# EAGLE design spherebot-r1 (EAGLE 5.12)
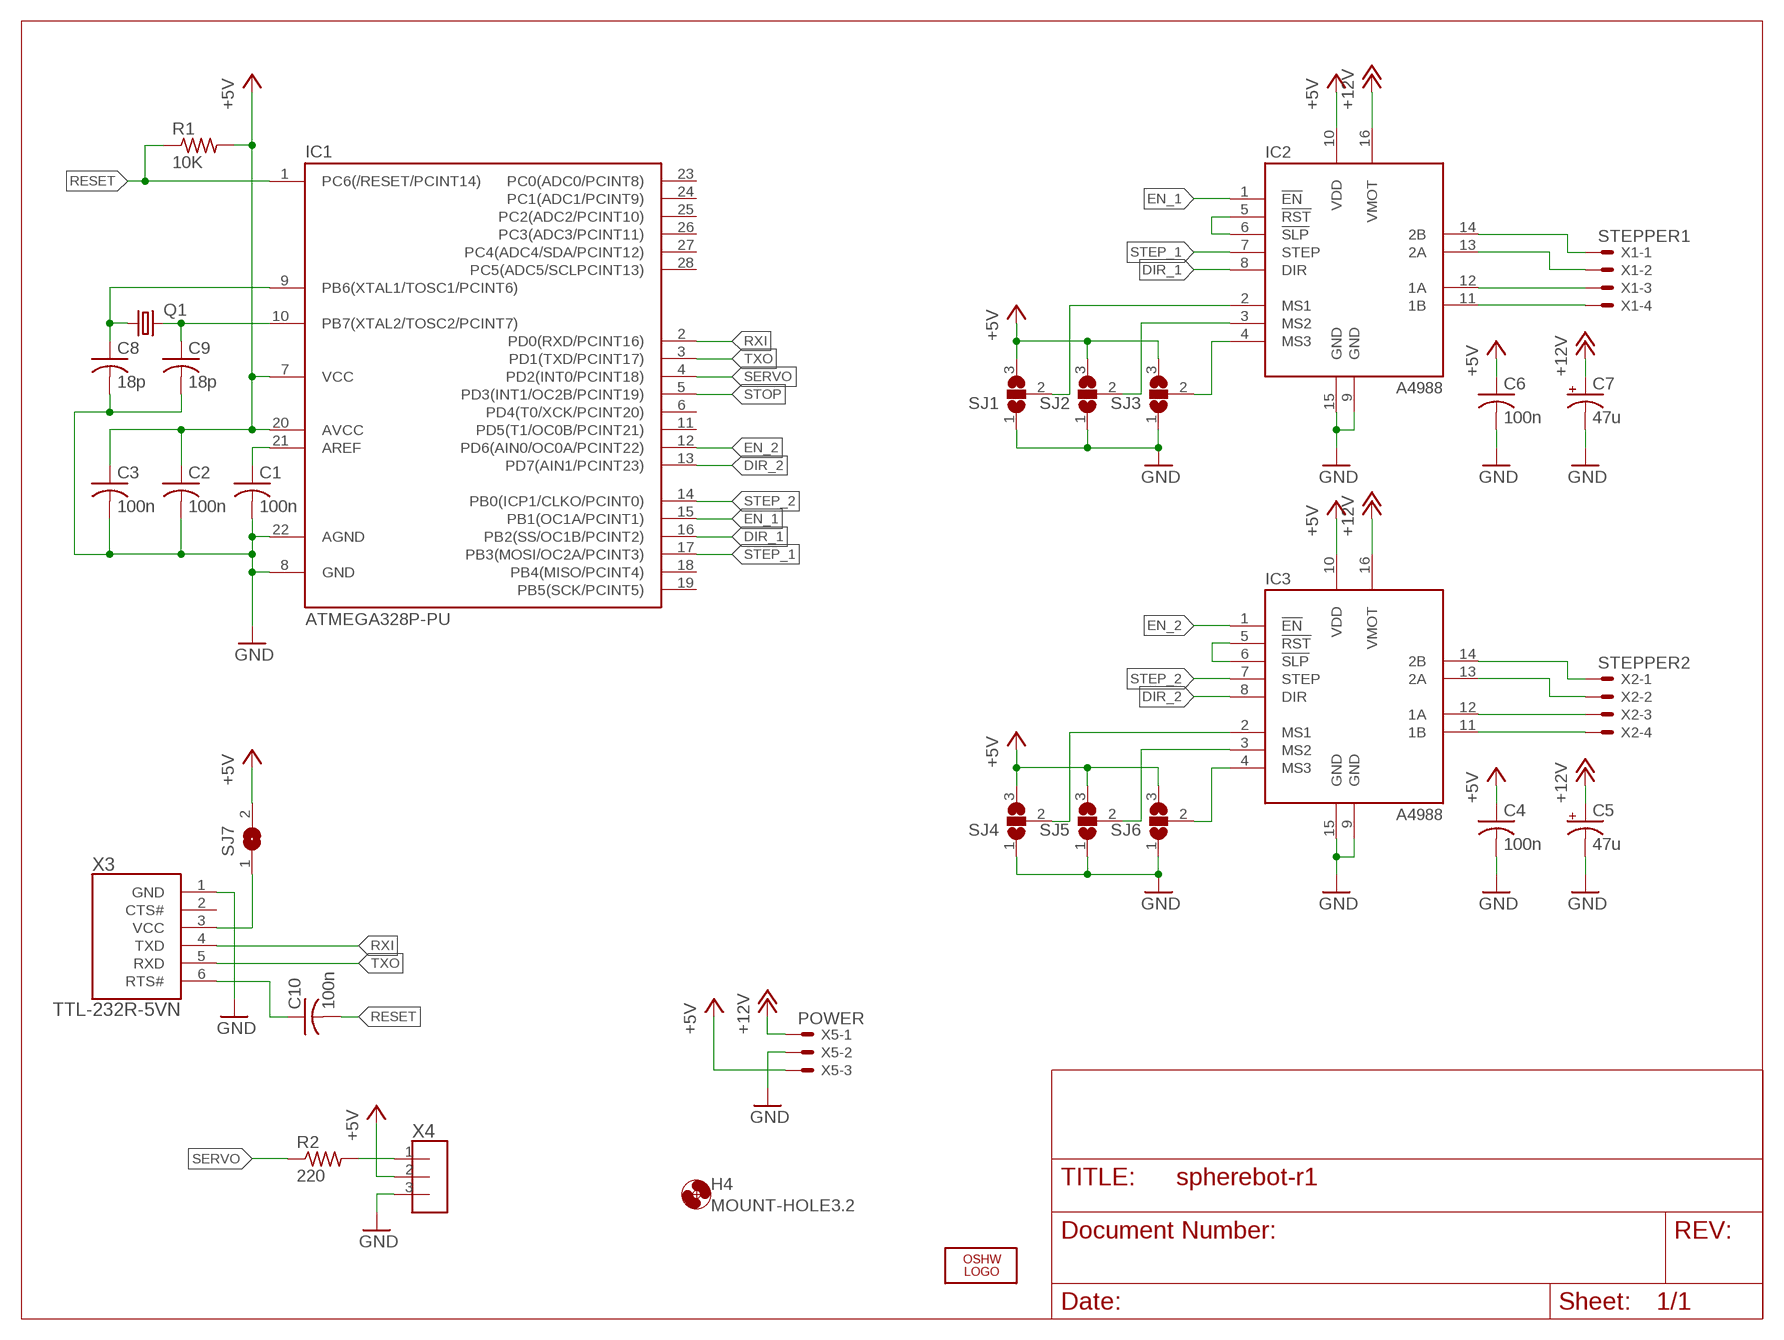
[diagram p0: schematic, sheet 1]

## Parts
C1  100n  C-US050-025X075  [C050-025X075]
C2  100n  C-US050-025X075  [C050-025X075]
C3  100n  C-US050-025X075  [C050-025X075]
C4  100n  C-US050-025X075  [C050-025X075]
C5  47u  CPOL-USE2.5-6  [E2,5-6]
C6  100n  C-US050-025X075  [C050-025X075]
C7  47u  CPOL-USE2.5-6  [E2,5-6]
C8  18p  C-US025-025X050  [C025-025X050]
C9  18p  C-US025-025X050  [C025-025X050]
C10  100n  C-US050-025X075  [C050-025X075]
H4  MOUNT-HOLE3.2  [3,2]
IC1  ATMEGA328P-PU  MEGA48/88/168-PU  [DIL28-3]
IC2  A4988  [POLOLU-STEPPER]
IC3  A4988  [POLOLU-STEPPER]
LOGO1  OSHW_LOGO_FILLX0150-NT  [OSHW_FILLX150_NOTEXT]
Q1  CRYSTALHC49S  [HC49/S]
R1  10K  R-US_0207/10  [0207/10]
R2  220  R-US_0207/10  [0207/10]
SJ1  SJ2W  [SJ_2]
SJ2  SJ2W  [SJ_2]
SJ3  SJ2W  [SJ_2]
SJ4  SJ2W  [SJ_2]
SJ5  SJ2W  [SJ_2]
SJ6  SJ2W  [SJ_2]
SJ7  SJ  [SJ]
X1  STEPPER1  22-23-2041  [22-23-2041]
X2  STEPPER2  22-23-2041  [22-23-2041]
X3  TTL-232R-5VN  [USBCABLE-0.100-NOLBL]
X4  M03-100MIL  [100MIL-3]
X5  POWER  22-23-2031  [22-23-2031]

## Nets
+5V: C2.1 C3.1 C4.1 C6.1 IC1.7(VCC) IC1.20(AVCC) IC2.10(VDD) IC3.10(VDD) R1.2 SJ1.3 SJ2.3 SJ3.3 SJ4.3 SJ5.3 SJ6.3 SJ7.2 X4.2 X5.3
+12V: C5.+ C7.+ IC2.16(VMOT) IC3.16(VMOT) X5.1
DIR_1: IC1.16(PB2(SS/OC1B/PCINT2)) IC2.8(DIR)
DIR_2: IC1.13(PD7(AIN1/PCINT23)) IC3.8(DIR)
EN_1: IC1.15(PB1(OC1A/PCINT1)) IC2.1(!EN)
EN_2: IC1.12(PD6(AIN0/OC0A/PCINT22)) IC3.1(!EN)
GND: C1.2 C2.2 C3.2 C4.2 C5.- C6.2 C7.- C8.2 C9.2 IC1.8(GND) IC1.22(AGND) IC2.9(GND) IC2.15(GND) IC3.9(GND) IC3.15(GND) SJ1.1 SJ2.1 SJ3.1 SJ4.1 SJ5.1 SJ6.1 X3.1(GND) X4.3 X5.2
N$1: IC2.14(2B) X1.1
N$2: IC2.13(2A) X1.2
N$3: IC2.12(1A) X1.3
N$4: IC2.5(!RST) IC2.6(!SLP)
N$5: IC2.11(1B) X1.4
N$6: IC3.5(!RST) IC3.6(!SLP)
N$7: C1.1 IC1.21(AREF)
N$8: IC3.14(2B) X2.1
N$9: IC3.13(2A) X2.2
N$10: IC3.12(1A) X2.3
N$11: IC3.11(1B) X2.4
N$12: C8.1 IC1.9(PB6(XTAL1/TOSC1/PCINT6)) Q1.1
N$13: C9.1 IC1.10(PB7(XTAL2/TOSC2/PCINT7)) Q1.2
N$14: IC2.2(MS1) SJ1.2
N$15: IC2.3(MS2) SJ2.2
N$16: IC2.4(MS3) SJ3.2
N$17: R2.2 X4.1
N$18: SJ7.1 X3.3(VCC)
N$19: IC3.2(MS1) SJ4.2
N$20: IC3.3(MS2) SJ5.2
N$21: IC3.4(MS3) SJ6.2
N$23: C10.1 X3.6(RTS#)
RESET: C10.2 IC1.1(PC6(/RESET/PCINT14)) R1.1
RXI: IC1.2(PD0(RXD/PCINT16)) X3.4(TXD)
SERVO: IC1.4(PD2(INT0/PCINT18)) R2.1
STEP_1: IC1.17(PB3(MOSI/OC2A/PCINT3)) IC2.7(STEP)
STEP_2: IC1.14(PB0(ICP1/CLKO/PCINT0)) IC3.7(STEP)
STOP: IC1.5(PD3(INT1/OC2B/PCINT19))
TXO: IC1.3(PD1(TXD/PCINT17)) X3.5(RXD)
Unconnected: IC1.6(PD4(T0/XCK/PCINT20)) IC1.11(PD5(T1/OC0B/PCINT21)) IC1.18(PB4(MISO/PCINT4)) IC1.19(PB5(SCK/PCINT5)) IC1.23(PC0(ADC0/PCINT8)) IC1.24(PC1(ADC1/PCINT9)) IC1.25(PC2(ADC2/PCINT10)) IC1.26(PC3(ADC3/PCINT11)) IC1.27(PC4(ADC4/SDA/PCINT12)) IC1.28(PC5(ADC5/SCLPCINT13)) X3.2(CTS#)

## Library data of the parts
C1-C4 C6 C8-C10 = rcl:C-US: CAPACITOR, American symbol
C5 C7 = rcl:CPOL-US: POLARIZED CAPACITOR, American symbol
H4 = holes:MOUNT-HOLE: MOUNTING HOLE with drill center marker
IC1 = avr-5:MEGA48/88/168-PU
IC2 IC3 = rbg-pololu-stepper:A4988
LOGO1 = ohw-logo:OSHW_LOGO_FILL
Q1 = crystal:CRYSTAL: CRYSTAL; OC_FARNELL: 1667008; OC_NEWARK: unknown
R1 R2 = rcl:R-US_: RESISTOR, American symbol
SJ1-SJ6 = jumper:SJ2W: SMD solder JUMPER
SJ7 = jumper:SJ: SMD solder JUMPER
X1 X2 = con-molex:22-23-2041: .100" (2.54mm) Center Header - 4 Pin; MF: MOLEX; MPN: 22-23-2041; OC_FARNELL: 1462920; OC_NEWARK: 38C0355
X3 = rbg-ftdi-usb:TTL-232R-5V
X4 = rbg-generic-headers:M03-100MIL
X5 = con-molex:22-23-2031: .100" (2.54mm) Center Header - 3 Pin; MF: MOLEX; MPN: 22-23-2031; OC_FARNELL: 1462950; OC_NEWARK: 30C0862

## Board
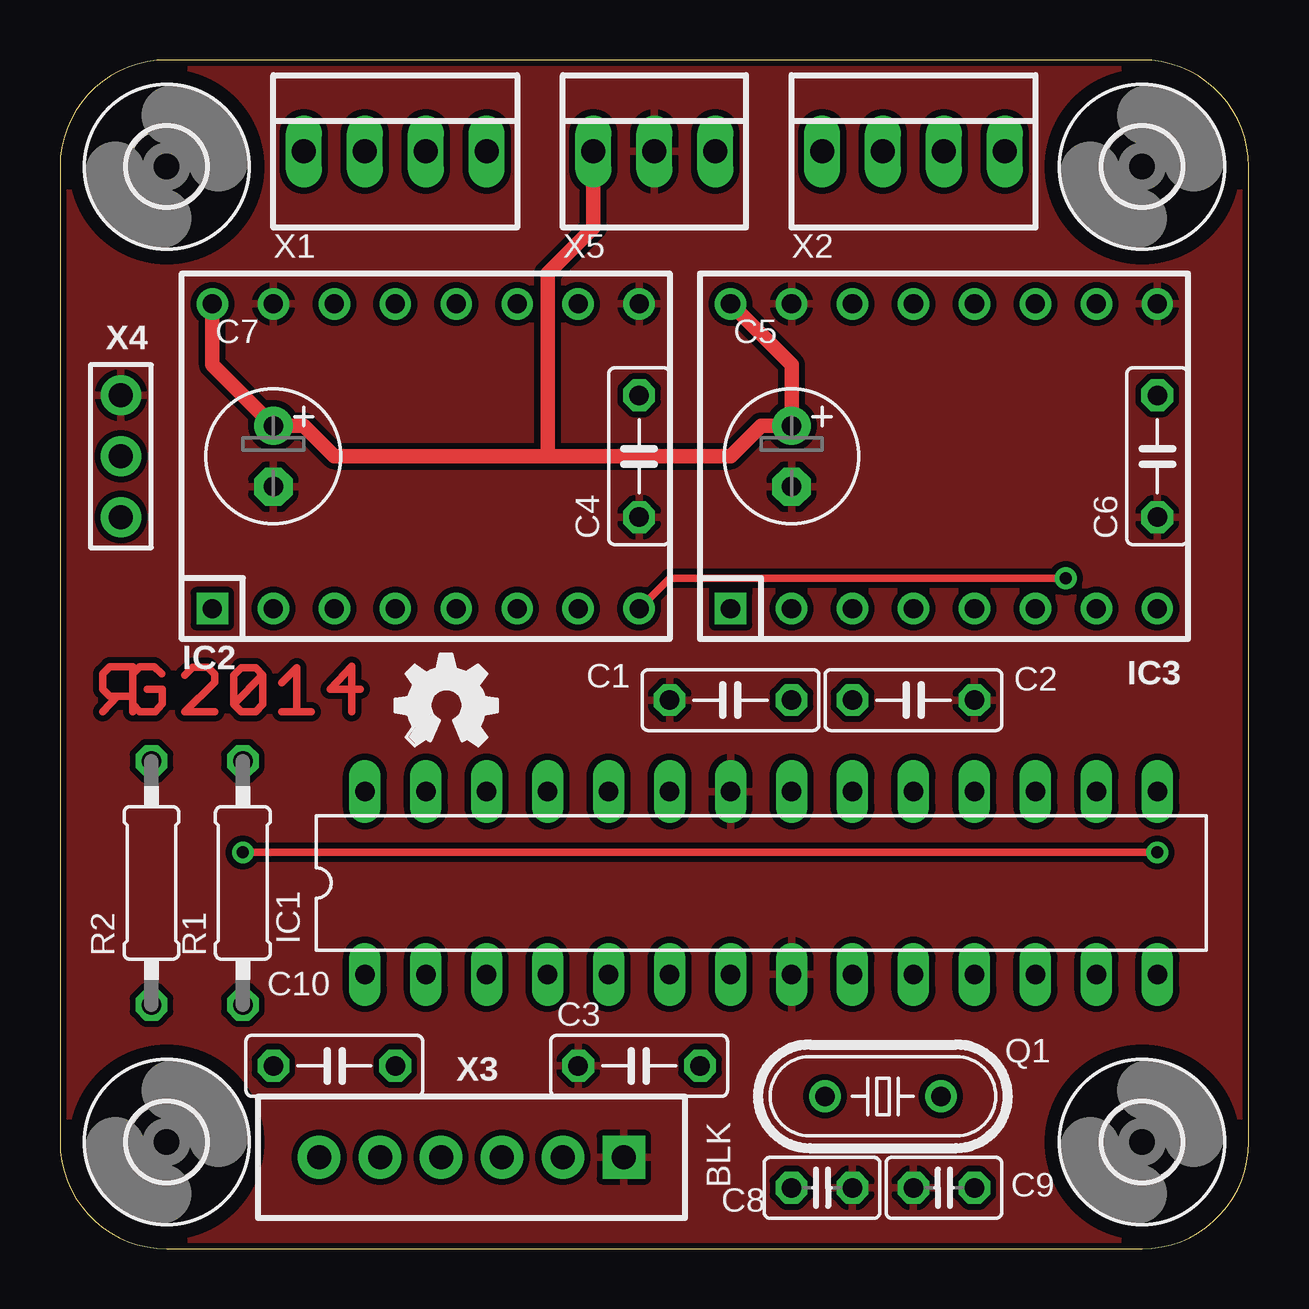
[diagram p1: board, top side]
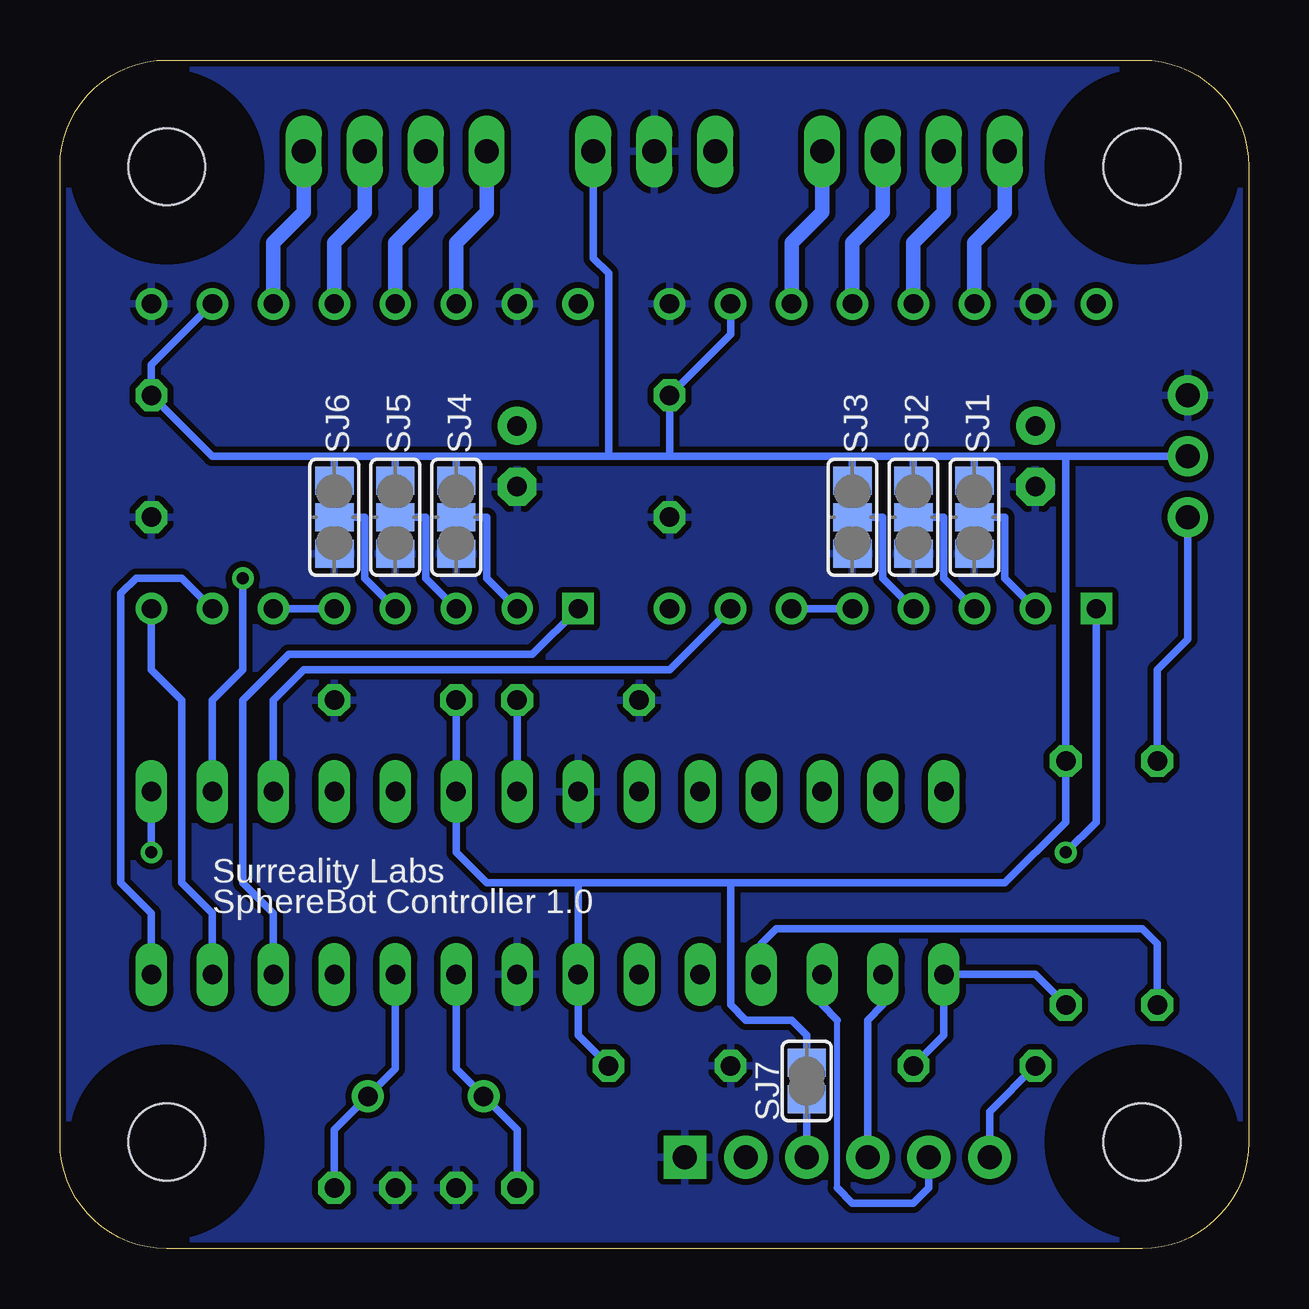
[diagram p2: board, bottom side, seen from below]

Size 49.53 x 49.53 mm. Coordinates in mm from the lower left corner, seen from the top.
Outline: 4.45,49.53 arc90 0,45.09 0,4.45 arc90 4.45,0 45.09,0 arc90 49.53,4.45 49.53,45.09 arc90 45.09,49.53 4.45,49.53
Copper layers (1*16): Top 0.035mm / dielectric 1.5mm / Bottom 0.035mm
Design rules "default *": minimum track width 10mil, minimum drill 0.5mm, track to track 10mil, track to pad 10mil, pad to pad 10mil, via to via 10mil, smd to smd 10mil, copper to edge 10mil, drill to drill 8mil, minimum pad ring 10mil, minimum via ring 8mil, stop-mask expansion 4mil, vias tented up to drill 20mil, thermal gap 10mil

### Footprints (pad centres in the part's own frame; a part is rotated, then mirrored left to right if it is on the bottom)
C050-025X075 = drill 0.813 octagon: 1 -2.54,0; 2 2.54,0
E2,5-6 = drill 0.813 pad 1.6 round: + -1.27,0 | drill 0.813 pad 1.6 octagon: - 1.27,0
C025-025X050 = drill 0.813 octagon: 1 -1.27,0; 2 1.27,0
3,2 = hole 3.2: 0,0
DIL28-3 = drill 0.813 long: 1 -16.51,-3.81; 2 -13.97,-3.81; 3 -11.43,-3.81; 4 -8.89,-3.81; 5 -6.35,-3.81; 6 -3.81,-3.81; 7 -1.27,-3.81; 8 1.27,-3.81; 9 3.81,-3.81; 10 6.35,-3.81; 11 8.89,-3.81; 12 11.43,-3.81; 13 13.97,-3.81; 14 16.51,-3.81; 15 16.51,3.81; 16 13.97,3.81; 17 11.43,3.81; 18 8.89,3.81; 19 6.35,3.81; 20 3.81,3.81; 21 1.27,3.81; 22 -1.27,3.81; 23 -3.81,3.81; 24 -6.35,3.81; 25 -8.89,3.81; 26 -11.43,3.81; 27 -13.97,3.81; 28 -16.51,3.81
POLOLU-STEPPER = drill 0.8 square: 1 -8.89,-6.35 | drill 0.8 round: 2 -6.35,-6.35; 3 -3.81,-6.35; 4 -1.27,-6.35; 5 1.27,-6.35; 6 3.81,-6.35; 7 6.35,-6.35; 8 8.89,-6.35; 9 8.89,6.35; 10 6.35,6.35; 11 3.81,6.35; 12 1.27,6.35; 13 -1.27,6.35; 14 -3.81,6.35; 15 -6.35,6.35; 16 -8.89,6.35
HC49/S = drill 0.813 round: 1 -2.413,0; 2 2.413,0
0207/10 = drill 0.813 octagon: 1 -5.08,0; 2 5.08,0
SJ_2 = smd 1.168 x 1.6: 1 -1.524,0; 2 0,0; 3 1.524,0
SJ = smd 1.168 x 1.6: 1 -0.762,0; 2 0.762,0
22-23-2041 = drill 1 long: 1 -3.81,0; 2 -1.27,0; 3 1.27,0; 4 3.81,0
USBCABLE-0.100-NOLBL = drill 1 pad 1.778 square: 1 0,-7.62 | drill 1 pad 1.778 round: 2 0,-5.08; 3 0,-2.54; 4 0,0; 5 0,2.54; 6 0,5.08
100MIL-3 = drill 1 pad 1.676 round: 1 -2.54,0; 2 0,0; 3 2.54,0
22-23-2031 = drill 1 long: 1 -2.54,0; 2 0,0; 3 2.54,0

### Placement (x,y rotation side)
C1  27.94,22.86 180 top
C2  35.56,22.86 0 top
C3  24.13,7.62 180 top
C4  24.13,33.02 270 top
C5  30.48,33.02 270 top
C6  45.72,33.02 270 top
C7  8.89,33.02 270 top
C8  31.75,2.54 0 top
C9  36.83,2.54 180 top
C10  11.43,7.62 0 top
H1  MOUNT-HOLE3.2  [3,2]  4.45,45.09 0 top
H2  MOUNT-HOLE3.2  [3,2]  45.09,45.09 0 top
H3  MOUNT-HOLE3.2  [3,2]  4.45,4.45 0 top
H4  45.09,4.45 0 top
IC1  29.21,15.24 0 top
IC2  15.24,33.02 0 top
IC3  36.83,33.02 0 top
LOGO1  13.97,20.95 0 top
Q1  34.29,6.35 0 top
R1  7.62,15.24 90 top
R2  3.81,15.24 90 top
SJ1  11.43,30.48 90 bottom
SJ2  13.97,30.48 90 bottom
SJ3  16.51,30.48 90 bottom
SJ4  33.02,30.48 90 bottom
SJ5  35.56,30.48 90 bottom
SJ6  38.1,30.48 90 bottom
SJ7  18.41,6.99 90 bottom
U$1  [RGLOGO_SMALL_2014]  3.17,22.23 0 top
X1  13.97,45.72 0 top
X2  35.56,45.72 0 top
X3  15.88,3.81 90 top
X4  2.54,33.02 90 top
X5  24.77,45.72 0 top

### Tracks (layer width: path | path; a pad name or v marks a point on that pad's centre or on a via)
+5V
  Bottom 0.305: C3.1 27.94,8.89 IC1.7 27.94,15.24 | C2.1 IC1.20 33.02,16.51 31.75,15.24 27.94,15.24 | IC2.10 21.59,38.1 C4.1 24.13,33.02 | 24.13,33.02 26.67,33.02 | 26.67,33.02 33.02,33.02 | 33.02,33.02 35.56,33.02 | 35.56,33.02 38.1,33.02 | 38.1,33.02 43.18,33.02 C6.1 45.72,36.83 IC3.10 | 7.62,33.02 R1.2 7.62,17.78 10.16,15.24 21.59,15.24 | 7.62,33.02 11.43,33.02 | 11.43,33.02 13.97,33.02 | 13.97,33.02 16.51,33.02 | 16.51,33.02 24.13,33.02 | 21.59,15.24 27.94,15.24 | 11.43,33.02 SJ1.3 | 13.97,33.02 SJ2.3 | 16.51,33.02 SJ3.3 | 38.1,33.02 SJ6.3 | 35.56,33.02 SJ5.3 | 33.02,33.02 SJ4.3 | 7.62,33.02 X4.2 | X5.3 27.3,41.27 26.67,40.64 26.67,33.02 | SJ7.2 18.41,8.89 19.05,9.53 20.95,9.53 21.59,10.16 21.59,15.24
+12V
  Top 0.61: IC2.16 6.35,36.83 C7.+ 10.16,34.29 11.43,33.02 20.32,33.02 | 20.32,33.02 27.94,33.02 29.21,34.29 C5.+ 30.48,36.83 IC3.16 | X5.1 22.23,42.55 20.32,40.64 20.32,33.02
DIR_1  (via drill 0.5)
  Top 0.305: v41.91,27.94 25.4,27.94 IC2.8
  Bottom 0.305: IC1.16 43.18,22.86 41.91,24.13 v41.91,27.94
DIR_2
  Bottom 0.305: IC1.13 43.18,13.97 44.45,15.24 44.45,22.86 45.72,24.13 IC3.8
EN_1  (via drill 0.5)
  Top 0.305: v7.62,16.51 v45.72,16.51
  Bottom 0.305: v45.72,16.51 IC1.15 | v7.62,16.51 6.35,17.78 IC2.1
EN_2
  Bottom 0.305: IC1.12 40.64,13.97 41.91,15.24 41.91,22.86 40.01,24.77 29.84,24.77 IC3.1
GND
  pour Bottom: -1.27,50.8 50.8,50.8 50.8,-1.27 -1.27,-1.27
  pour Top: -1.27,50.8 50.8,50.8 50.8,-1.27 -1.27,-1.27
N$1
  Bottom 0.61: IC2.14 11.43,41.91 10.16,43.18 X1.1
N$2
  Bottom 0.61: IC2.13 13.97,41.91 12.7,43.18 X1.2
N$3
  Bottom 0.61: IC2.12 16.51,41.91 15.24,43.18 X1.3
N$4
  Bottom 0.305: IC2.5 IC2.6
N$5
  Bottom 0.61: IC2.11 19.05,41.91 17.78,43.18 X1.4
N$6
  Bottom 0.305: IC3.5 IC3.6
N$7
  Bottom 0.305: IC1.21 C1.1
N$8
  Bottom 0.61: IC3.14 33.02,41.91 31.75,43.18 X2.1
N$9
  Bottom 0.61: IC3.13 35.56,41.91 34.29,43.18 X2.2
N$10
  Bottom 0.61: IC3.12 38.1,41.91 36.83,43.18 X2.3
N$11
  Bottom 0.61: IC3.11 40.64,41.91 39.37,43.18 X2.4
N$12
  Bottom 0.305: IC1.9 33.02,7.49 Q1.1 30.48,4.95 C8.1
N$13
  Bottom 0.305: IC1.10 35.56,7.49 Q1.2 38.1,4.95 C9.1
N$14
  Bottom 0.305: SJ1.2 10.16,30.48 10.16,27.94 IC2.2
N$15
  Bottom 0.305: SJ2.2 12.7,30.48 12.7,27.94 IC2.3
N$16
  Bottom 0.305: SJ3.2 15.24,30.48 15.24,27.94 IC2.4
N$17
  Bottom 0.305: X4.1 2.54,25.4 3.81,24.13 R2.2
N$18
  Bottom 0.305: X3.3 SJ7.1
N$19
  Bottom 0.305: SJ4.2 31.75,30.48 31.75,27.94 IC3.2
N$20
  Bottom 0.305: SJ5.2 34.29,30.48 34.29,27.94 IC3.3
N$21
  Bottom 0.305: SJ6.2 36.83,30.48 36.83,27.94 IC3.4
N$23
  Bottom 0.305: X3.6 10.79,5.71 C10.1
RESET
  Bottom 0.305: R1.1 8.89,11.43 IC1.1 12.7,8.89 C10.2
RXI
  Bottom 0.305: X3.4 15.88,9.53 15.24,10.16 IC1.2
SERVO
  Bottom 0.305: IC1.4 20.32,12.7 19.68,13.34 4.45,13.34 3.81,12.7 R2.1
STEP_1
  Bottom 0.305: IC1.17 40.64,22.86 39.37,24.13 24.13,24.13 IC2.7
STEP_2
  Bottom 0.305: IC3.7 44.45,27.94 46.35,27.94 46.99,27.3 46.99,15.24 45.72,13.97 IC1.14
TXO
  Bottom 0.254: 17.14,2.54 17.14,9.53
  Bottom 0.305: IC1.3 17.78,10.16 17.14,9.53 | 17.14,2.54 16.51,1.91 13.97,1.91 13.34,2.54 X3.5

### Text on the board
bNames: Surreality Labs | SphereBot Controller 1.0